# Altium schematic sheet Schematic ESP.SchDoc
size 840 x 594 mm; ApprovedBy: Губар В.Г.; CompanyName: НТУУ "КПІ"; DrawnBy: Поправка Є.І.; DocumentNumber: ДК21.141655.002 Е3; SheetNumber: 1; SheetTotal: 1; Scale: 1:1; TitleString01: Реєстратор бездро-; PageSetup: Record=PageOptions|CenterHorizontal=False|CenterVertical=False|PrintScale=0.49|XCorrection=0.00|YCorrection=0.00|PrintKind=1|BorderSize=5000000|LeftOffset=0|BottomOffset=0|Orientation=1|PaperLength=1000|PaperWidth=1000|Scale=100|PaperSource=15|PrintQuality=600|MediaType=1|DitherType=10|PrintScaleMode=1|PaperKind=A4; TitleString02: тових перепусток; ЕСКД: 2.104-2006
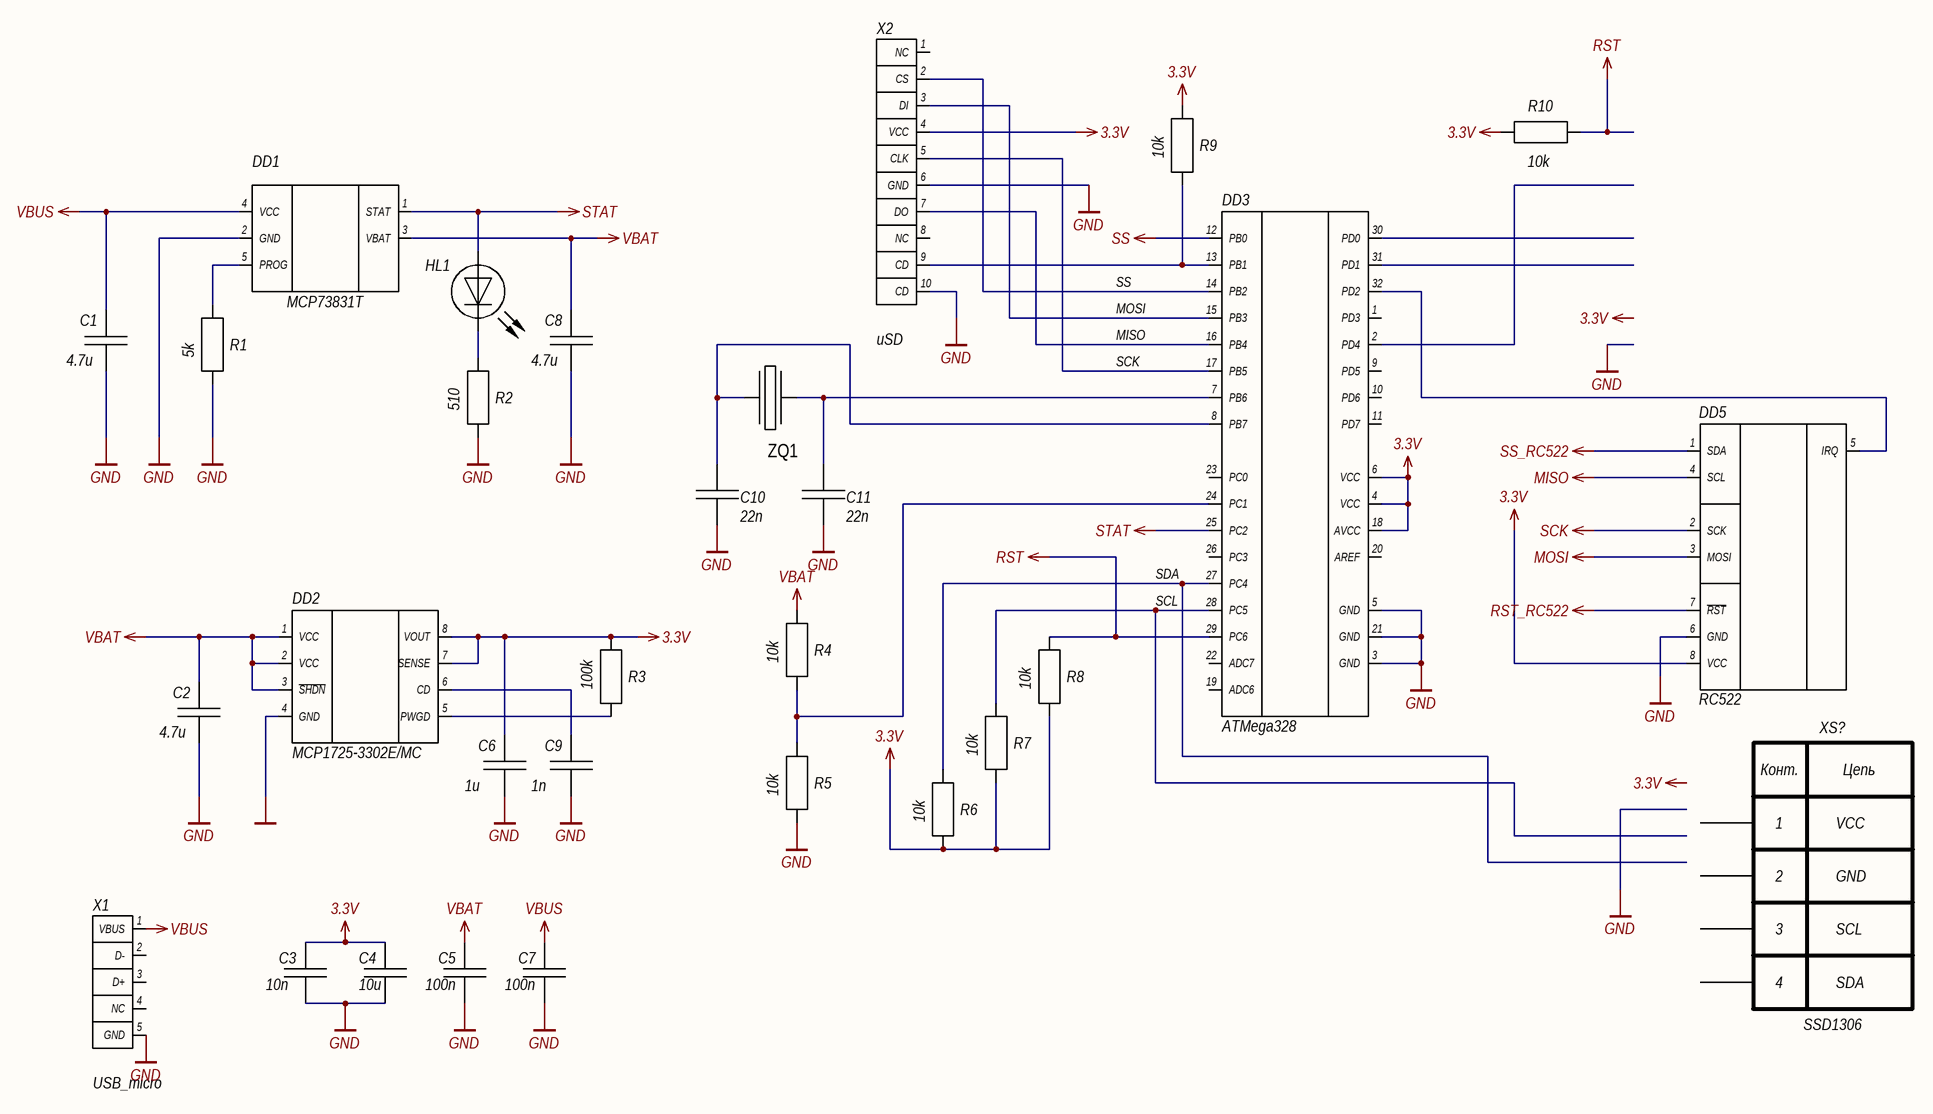
[diagram p0: Schematic ESP.SchDoc]

## Parts
C1  value 4.7u  [CAPC2113X06N]  (hidden comment: C0805)
C2  value 4.7u  [CAPC2113X06N]  (hidden comment: C0805)
C3  value 10n  [CAPC2113X06N]  (hidden comment: C0805)
C4  value 10u  [CAPC2113X06N]  (hidden comment: C0805)
C5  value 100n  [CAPC2113X06N]  (hidden comment: C0805)
C6  value 1u  [CAPC2113X06N]  (hidden comment: C0805)
C7  value 100n  [CAPC2113X06N]  (hidden comment: C0805)
C8  value 4.7u  [CAPC2113X06N]  (hidden comment: C0805)
C9  value 1n  [CAPC2113X06N]  (hidden comment: C0805)
C10  value 22n  [CAPC2113X06N]  (hidden comment: C0805)
C11  value 22n  [CAPC2113X06N]  (hidden comment: C0805)
DD1  MCP73831T  [SOT95P270X145-5N]
DD2  MCP1725-3302E/MC  [SOIC127P600X175-8N]
DD3  ATMega328  [TQFP80P900X900X120-32N]
DD5  RC522  [RFID-RC522]
HL1  LED0805  [CAPC2113X06N]  (value not drawn)
R1  value 5k  [CAPC2113X06N]  (hidden comment: R0805)
R2  value 510  [CAPC2113X06N]  (hidden comment: R0805)
R3  value 100k  [CAPC2113X06N]  (hidden comment: R0805)
R4  value 10k  [CAPC2113X06N]  (hidden comment: R0805)
R5  value 10k  [CAPC2113X06N]  (hidden comment: R0805)
R6  value 10k  [CAPC2113X06N]  (hidden comment: R0805)
R7  value 10k  [CAPC2113X06N]  (hidden comment: R0805)
R8  value 10k  [CAPC2113X06N]  (hidden comment: R0805)
R9  value 10k  [CAPC2113X06N]  (hidden comment: R0805)
R10  value 10k  [CAPC2113X06N]  (hidden comment: R0805)
X1  USB_micro  [MiniUSB Socket]
X2  uSD  [MICROSD Slot]
XS?  SSD1306  [RFID-RC522]
ZQ1  ZQ_01  [HC49]  (value not drawn)

## Nets
3.3V: C3.1 C4.1 C6.2 DD2.7(SENSE) DD2.8(VOUT) DD3.4(VCC) DD3.6(VCC) DD3.18(AVCC) DD5.8(VCC) R3.1(Terminal_A) R6.2(Terminal_B) R7.2(Terminal_B) R8.2(Terminal_B) R9.2(Terminal_B) R10.1(Terminal_A) X2.4(VCC)
GND: C1.1 C2.1 C3.2 C4.2 C5.2 C6.1 C7.2 C8.1 C9.1 C10.1 C11.1 DD1.2(GND) DD2.4(GND) DD3.3(GND) DD3.5(GND) DD3.21(GND) DD5.6(GND) R1.2(Terminal_B) R2.2(Terminal_B) R5.2(Terminal_B) X1.5(GND) X2.6(GND) X2.10(CD)
MISO: DD3.16(PB4) DD5.4(SCL) X2.7(DO)
MOSI: DD3.15(PB3) DD5.3(MOSI) X2.3(DI)
RST: DD3.29(PC6) R8.1(Terminal_A) R10.2(Terminal_B)
RST_RC522: DD5.7(~{RST})
SCK: DD3.17(PB5) DD5.2(SCK) X2.5(CLK)
SS: DD3.12(PB0) DD3.14(PB2) X2.2(CS)
SS_RC522: DD5.1(SDA)
STAT: DD1.1(STAT) DD3.25(PC2) HL1.1(A)
VBAT: C2.2 C5.1 C8.2 DD1.3(VBAT) DD2.1(VCC) DD2.2(VCC) DD2.3(~{SHDN}) R4.1(Terminal_A)
VBUS: C1.2 C7.1 DD1.4(VCC) X1.1(VBUS)
SCL: DD3.28(PC5) R7.1(Terminal_A)
SDA: DD3.27(PC4) R6.1(Terminal_A)
NetC9_2: C9.2 DD2.6(CD)
NetC10_2: C10.2 DD3.8(PB7) ZQ1.1
NetC11_2: C11.2 DD3.7(PB6) ZQ1.2
NetDD1_5: DD1.5(PROG) R1.1(Terminal_A)
NetDD2_5: DD2.5(PWGD) R3.2(Terminal_B)
NetDD3_13: DD3.13(PB1) R9.1(Terminal_A) X2.9(CD)
NetDD3_24: DD3.24(PC1) R4.2(Terminal_B) R5.1(Terminal_A)
NetDD3_32: DD3.32(PD2) DD5.5(IRQ)
NetHL1_2: HL1.2(K) R2.1(Terminal_A)

Not connected (* = marked no-connect by the designer): DD3 1(PD3) 2(PD4) 9(PD5) 10(PD6) 11(PD7) 19(ADC6) 20(AREF) 22(ADC7) 23(PC0) 26(PC3) 30(PD0) 31(PD1); X1 2(D-) 3(D+) 4(NC); X2 1(NC) 8(NC); XS? 1(VCC) 2(GND) 3(SCL) 4(SDA)

## Notes on the sheet
- Labels drawn without touching a wire or pin: 3.3V
- Подп. и дата
- Инв. № дубл.
- Взам. инв. №
- Изм.
- Разраб.
- Лист
- № докум.
- Подп.
- Дата
- Лит.
- Масса
- Масштаб
- Пров.
- Т.контр.
- Листов
- Утв.
- Н.контр.
- Инв. № подл.
- Копировал
- Формат А1
- (in symbol SSD1306) Конт.; Цепь

## Library data of the parts
C1-C11 = C0805: Chip capasitor; Manufacter: MURATA; Part Number: GRJ32ER71H475KE11; Voltage: 50V; Tolerance: ±5%; Rem: SMD 0805
DD1 = MCP73831T: MCP73831T Li-ion/Li-po charger; Manufacter: Microchip; Part Number: MCP73831/2  SOT-23-5
DD2 = MCP1725-3302E/MC: MCP1725-3302E/MC ULDO; Manufacter: Microchip; Part Number: MCP1725-3302E/MC
DD3 = ATMega328: Atmel ATMega328 MCU; Part Number: ATmega328P; ValueDescription: zbs; ValueType: 1; Manufacter: ATMEL; ValueManufacturerPartNumber: ATMega328P; ValueManufacturer: ATMEL
DD5 = RC522: RC522 RFID module; Manufacter: NXP; Part Number: RFID-RC522 MFRC522 модуль
HL1 = HL_02: Светодиод; Manufacter: Kingbright; Part Number: KP-2012VGC-A
R1-R10 = R0805: Резистор; Part Number: RC0805JR-070RL; Manufacter: YAGEO; Voltage: 150V; Tolerance: ±5%
X1 = USB: USB micro; Manufacter: MOLEX; Part Number: 47346-0001 uUSB роз'єм
X2 = uSD slot: Manufacter: MOLEX; Part Number: 47346-0001 uSD роз'єм
XS? = SSD1306: SSD1306 OLED Screen Module; Manufacter: NXP; Part Number: RFID-RC522 MFRC522 модуль
ZQ1 = ZQ_01: Элемент пьезоэлектрический с двумя выводами; Part Number: HC49/US 16MHz; Manufacter: CITIZEN